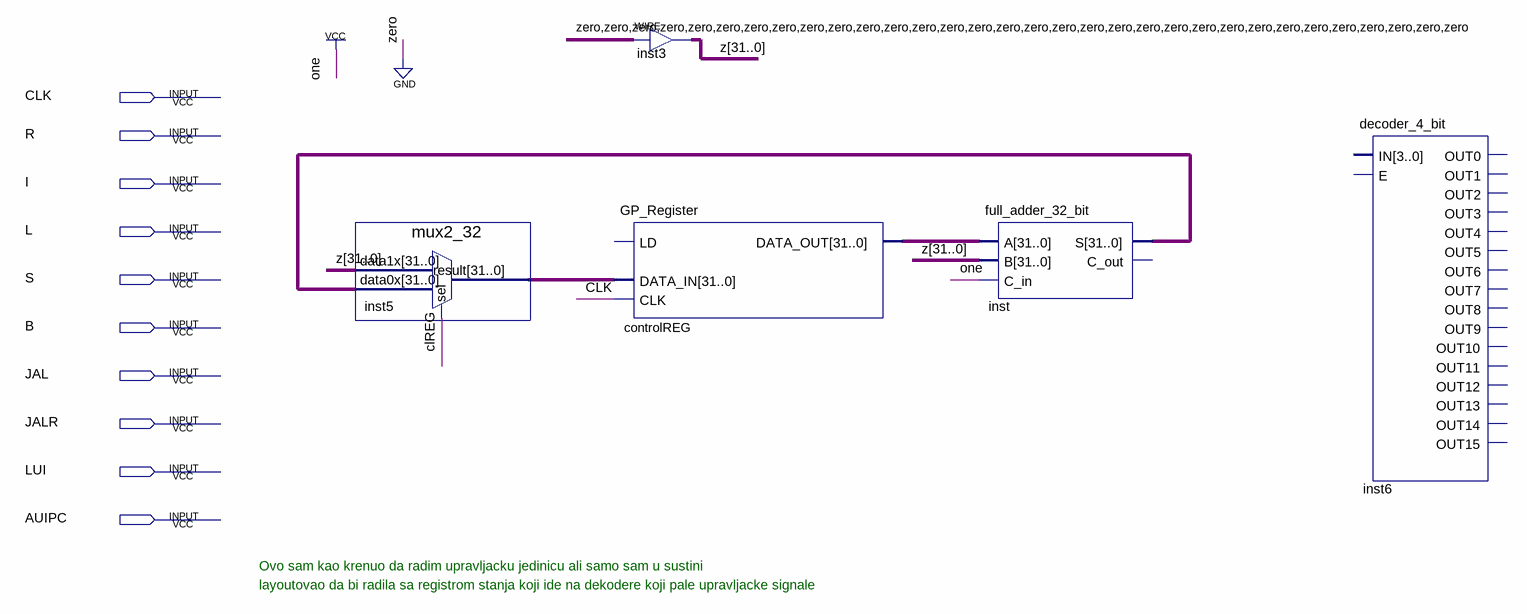
[diagram p0: schematic sheet]
// Quartus schematic ControlUnit.bdf as structural Verilog: 5 symbols, 10 pins
module ControlUnit (
  input  CLK,
  input  R,
  input  I,
  input  L,
  input  S,
  input  B,
  input  JAL,
  input  JALR,
  input  LUI,
  input  AUIPC
);

  wire clREG;
  wire [31:0] controlREG_data_out, inst5_result, inst_s, z;

  mux2_32 inst5 (.data1x(z), .data0x(inst_s), .sel(clREG), .result(inst5_result));
  assign z = {32{1'b0}};  // WIRE inst3
  GP_Register controlREG (.DATA_IN(inst5_result), .CLK(CLK), .DATA_OUT(controlREG_data_out));  // open: LD
  full_adder_32_bit inst (.A(controlREG_data_out), .B(z), .C_in(1'b1), .S(inst_s));  // open: C_out
  decoder_4_bit inst6 ();  // open: IN, E, OUT0, OUT1, OUT2, OUT3, OUT4, OUT5, OUT6, OUT7, OUT8, OUT9, OUT10, OUT11, OUT12, OUT13, OUT14, OUT15

  // Notes on the sheet:
  //   Ovo sam kao krenuo da radim upravljacku jedinicu ali samo sam u sustini              
  //   layoutovao da bi radila sa registrom stanja koji ide na dekodere koji pale upravljacke signale             
endmodule
